# EAGLE design clock_v2 (EAGLE 9.1.3)
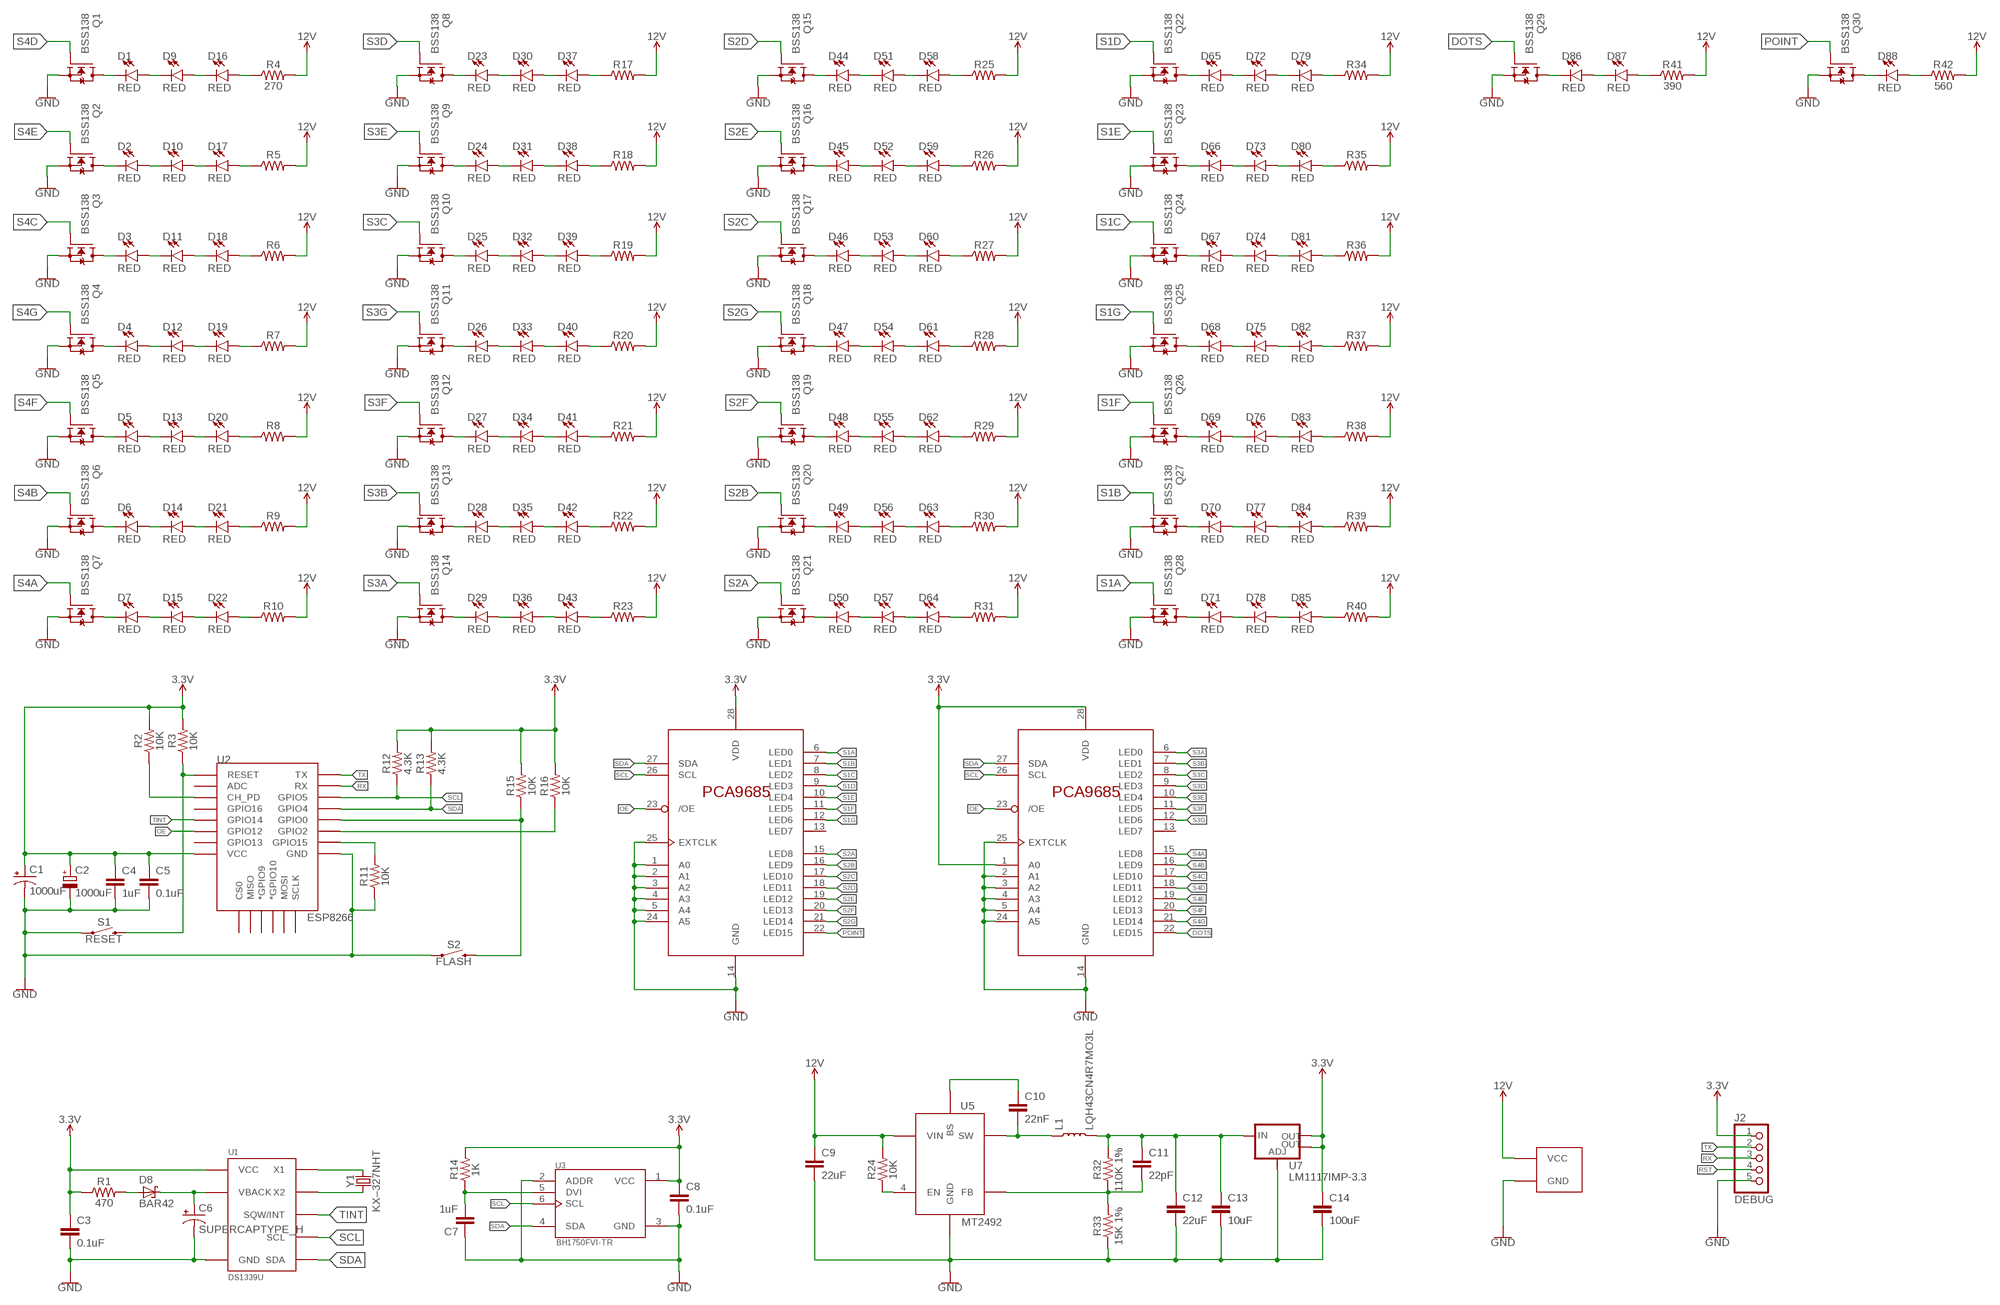
[diagram p0: schematic, sheet 1]

## Parts
C1  1000uF  CAP-RADIAL-8MM  [CAP_8X11.5_P-3.5]
C2  1000uF  CPOL-EUD/7343-31R  [D/7343-31R]
C3  0.1uF  1.0UF-1206-50V-10%  [1206]
C4  1uF  1.0UF-1206-50V-10%  [1206]
C5  0.1uF  1.0UF-1206-50V-10%  [1206]
C6  SUPERCAPTYPE_H  [IONISTOR_TYPE_H]
C7  1uF  1.0UF-1206-50V-10%  [1206]
C8  0.1uF  1.0UF-1206-50V-10%  [1206]
C9  22uF  1.0UF-1206-50V-10%  [1206]
C10  22nF  1.0UF-1206-50V-10%  [1206]
C11  22pF  1.0UF-1206-50V-10%  [1206]
C12  22uF  1.0UF-1206-50V-10%  [1206]
C13  10uF  1.0UF-1206-50V-10%  [1206]
C14  100uF  CAP_TANTALUM_C  [C/6032-28R]
D1  RED  LED-RED1206  [LED-1206]
D2  RED  LED-RED1206  [LED-1206]
D3  RED  LED-RED1206  [LED-1206]
D4  RED  LED-RED1206  [LED-1206]
D5  RED  LED-RED1206  [LED-1206]
D6  RED  LED-RED1206  [LED-1206]
D7  RED  LED-RED1206  [LED-1206]
D8  BAR42  [SOT23]
D9  RED  LED-RED1206  [LED-1206]
D10  RED  LED-RED1206  [LED-1206]
D11  RED  LED-RED1206  [LED-1206]
D12  RED  LED-RED1206  [LED-1206]
D13  RED  LED-RED1206  [LED-1206]
D14  RED  LED-RED1206  [LED-1206]
D15  RED  LED-RED1206  [LED-1206]
D16  RED  LED-RED1206  [LED-1206]
D17  RED  LED-RED1206  [LED-1206]
D18  RED  LED-RED1206  [LED-1206]
D19  RED  LED-RED1206  [LED-1206]
D20  RED  LED-RED1206  [LED-1206]
D21  RED  LED-RED1206  [LED-1206]
D22  RED  LED-RED1206  [LED-1206]
D23  RED  LED-RED1206  [LED-1206]
D24  RED  LED-RED1206  [LED-1206]
D25  RED  LED-RED1206  [LED-1206]
D26  RED  LED-RED1206  [LED-1206]
D27  RED  LED-RED1206  [LED-1206]
D28  RED  LED-RED1206  [LED-1206]
D29  RED  LED-RED1206  [LED-1206]
D30  RED  LED-RED1206  [LED-1206]
D31  RED  LED-RED1206  [LED-1206]
D32  RED  LED-RED1206  [LED-1206]
D33  RED  LED-RED1206  [LED-1206]
D34  RED  LED-RED1206  [LED-1206]
D35  RED  LED-RED1206  [LED-1206]
D36  RED  LED-RED1206  [LED-1206]
D37  RED  LED-RED1206  [LED-1206]
D38  RED  LED-RED1206  [LED-1206]
D39  RED  LED-RED1206  [LED-1206]
D40  RED  LED-RED1206  [LED-1206]
D41  RED  LED-RED1206  [LED-1206]
D42  RED  LED-RED1206  [LED-1206]
D43  RED  LED-RED1206  [LED-1206]
D44  RED  LED-RED1206  [LED-1206]
D45  RED  LED-RED1206  [LED-1206]
D46  RED  LED-RED1206  [LED-1206]
D47  RED  LED-RED1206  [LED-1206]
D48  RED  LED-RED1206  [LED-1206]
D49  RED  LED-RED1206  [LED-1206]
D50  RED  LED-RED1206  [LED-1206]
D51  RED  LED-RED1206  [LED-1206]
D52  RED  LED-RED1206  [LED-1206]
D53  RED  LED-RED1206  [LED-1206]
D54  RED  LED-RED1206  [LED-1206]
D55  RED  LED-RED1206  [LED-1206]
D56  RED  LED-RED1206  [LED-1206]
D57  RED  LED-RED1206  [LED-1206]
D58  RED  LED-RED1206  [LED-1206]
D59  RED  LED-RED1206  [LED-1206]
D60  RED  LED-RED1206  [LED-1206]
D61  RED  LED-RED1206  [LED-1206]
D62  RED  LED-RED1206  [LED-1206]
D63  RED  LED-RED1206  [LED-1206]
D64  RED  LED-RED1206  [LED-1206]
D65  RED  LED-RED1206  [LED-1206]
D66  RED  LED-RED1206  [LED-1206]
D67  RED  LED-RED1206  [LED-1206]
D68  RED  LED-RED1206  [LED-1206]
D69  RED  LED-RED1206  [LED-1206]
D70  RED  LED-RED1206  [LED-1206]
D71  RED  LED-RED1206  [LED-1206]
D72  RED  LED-RED1206  [LED-1206]
D73  RED  LED-RED1206  [LED-1206]
D74  RED  LED-RED1206  [LED-1206]
D75  RED  LED-RED1206  [LED-1206]
D76  RED  LED-RED1206  [LED-1206]
D77  RED  LED-RED1206  [LED-1206]
D78  RED  LED-RED1206  [LED-1206]
D79  RED  LED-RED1206  [LED-1206]
D80  RED  LED-RED1206  [LED-1206]
D81  RED  LED-RED1206  [LED-1206]
D82  RED  LED-RED1206  [LED-1206]
D83  RED  LED-RED1206  [LED-1206]
D84  RED  LED-RED1206  [LED-1206]
D85  RED  LED-RED1206  [LED-1206]
D86  RED  LED-RED1206  [LED-1206]
D87  RED  LED-RED1206  [LED-1206]
D88  RED  LED-RED1206  [LED-1206]
J1  POWER_SMD5.08  [POWER_SMD_5.08]
J2  DEBUG  ESP8266_DEBUG  [ESP8266_DEBUG]
L1  LQH43CN4R7MO3L  INDUCTOR_SMD_1812  [C1812]
Q1  BSS138  [SOT23]
Q2  BSS138  [SOT23]
Q3  BSS138  [SOT23]
Q4  BSS138  [SOT23]
Q5  BSS138  [SOT23]
Q6  BSS138  [SOT23]
Q7  BSS138  [SOT23]
Q8  BSS138  [SOT23]
Q9  BSS138  [SOT23]
Q10  BSS138  [SOT23]
Q11  BSS138  [SOT23]
Q12  BSS138  [SOT23]
Q13  BSS138  [SOT23]
Q14  BSS138  [SOT23]
Q15  BSS138  [SOT23]
Q16  BSS138  [SOT23]
Q17  BSS138  [SOT23]
Q18  BSS138  [SOT23]
Q19  BSS138  [SOT23]
Q20  BSS138  [SOT23]
Q21  BSS138  [SOT23]
Q22  BSS138  [SOT23]
Q23  BSS138  [SOT23]
Q24  BSS138  [SOT23]
Q25  BSS138  [SOT23]
Q26  BSS138  [SOT23]
Q27  BSS138  [SOT23]
Q28  BSS138  [SOT23]
Q29  BSS138  [SOT23]
Q30  BSS138  [SOT23]
R1  470  RESISTOR1206  [1206]
R2  10K  RESISTOR1206  [1206]
R3  10K  RESISTOR1206  [1206]
R4  270  RESISTOR1206  [1206]
R5  RESISTOR1206  [1206]
R6  RESISTOR1206  [1206]
R7  RESISTOR1206  [1206]
R8  RESISTOR1206  [1206]
R9  RESISTOR1206  [1206]
R10  RESISTOR1206  [1206]
R11  10K  RESISTOR1206  [1206]
R12  4.3K  RESISTOR1206  [1206]
R13  4.3K  RESISTOR1206  [1206]
R14  1K  RESISTOR1206  [1206]
R15  10K  RESISTOR1206  [1206]
R16  10K  RESISTOR1206  [1206]
R17  RESISTOR1206  [1206]
R18  RESISTOR1206  [1206]
R19  RESISTOR1206  [1206]
R20  RESISTOR1206  [1206]
R21  RESISTOR1206  [1206]
R22  RESISTOR1206  [1206]
R23  RESISTOR1206  [1206]
R24  10K  RESISTOR1206  [1206]
R25  RESISTOR1206  [1206]
R26  RESISTOR1206  [1206]
R27  RESISTOR1206  [1206]
R28  RESISTOR1206  [1206]
R29  RESISTOR1206  [1206]
R30  RESISTOR1206  [1206]
R31  RESISTOR1206  [1206]
R32  110K 1%  RESISTOR1206  [1206]
R33  15K 1%  RESISTOR1206  [1206]
R34  RESISTOR1206  [1206]
R35  RESISTOR1206  [1206]
R36  RESISTOR1206  [1206]
R37  RESISTOR1206  [1206]
R38  RESISTOR1206  [1206]
R39  RESISTOR1206  [1206]
R40  RESISTOR1206  [1206]
R41  390  RESISTOR1206  [1206]
R42  560  RESISTOR1206  [1206]
S1  RESET  MOMENTARY-SWITCH-SPST-SMD-5.2-REDUNDANT  [TACTILE_SWITCH_SMD_5.2MM]
S2  FLASH  MOMENTARY-SWITCH-SPST-SMD-5.2-REDUNDANT  [TACTILE_SWITCH_SMD_5.2MM]
U1  DS1339U  [DS1339U]
U2  ESP8266  ESP12ESMD  [ESP12E-SMD]
U3  BH1750FVI-TR  [SOTFL50P300X75-6N]
U4  PCA9685PW  [TSSOP28]
U5  MT2492  [SOT23-6]
U6  PCA9685PW  [TSSOP28]
U7  LM1117IMP-3.3  V_REG_LM1117SOT223  [SOT223]
Y1  KX–327NHT  [QSMD3.2X1.5]

## Nets
3.3V [power]: C1.+ C2.+ C3.1 C4.1 C5.1 C8.1 C14.+ J2.1 R1.1 R2.2 R3.2 R12.2 R13.2 R14.2 R15.2 R16.2 U1.8(VCC) U2.VCC U3.1(VCC) U4.28(VDD) U6.1(A0) U6.28(VDD) U7.2(OUT) U7.4(OUT)
12V [12V]: C9.1 J1.VCC R4.2 R5.2 R6.2 R7.2 R8.2 R9.2 R10.2 R17.2 R18.2 R19.2 R20.2 R21.2 R22.2 R23.2 R24.2 R25.2 R26.2 R27.2 R28.2 R29.2 R30.2 R31.2 R34.2 R35.2 R36.2 R37.2 R38.2 R39.2 R40.2 R41.2 R42.2 U5.5(VIN)
DOTS: Q29.1(G) U6.22(LED15)
FLASH: R15.1 S2.3 S2.4 U2.GPIO0
GND [power]: C1.- C2.- C3.2 C4.2 C5.2 C6.GND(-) C7.1 C8.2 C9.2 C12.2 C13.2 C14.- J1.GND J2.5 Q1.2(S) Q2.2(S) Q3.2(S) Q4.2(S) Q5.2(S) Q6.2(S) Q7.2(S) Q8.2(S) Q9.2(S) Q10.2(S) Q11.2(S) Q12.2(S) Q13.2(S) Q14.2(S) Q15.2(S) Q16.2(S) Q17.2(S) Q18.2(S) Q19.2(S) Q20.2(S) Q21.2(S) Q22.2(S) Q23.2(S) Q24.2(S) Q25.2(S) Q26.2(S) Q27.2(S) Q28.2(S) Q29.2(S) Q30.2(S) R11.1 R33.1 S1.1 S1.2 S2.1 S2.2 U1.4(GND) U2.GND U3.2(ADDR) U3.3(GND) U4.1(A0) U4.2(A1) U4.3(A2) U4.4(A3) U4.5(A4) U4.14(GND) U4.24(A5) U4.25(EXTCLK) U5.2(GND) U6.2(A1) U6.3(A2) U6.4(A3) U6.5(A4) U6.14(GND) U6.24(A5) U6.25(EXTCLK) U7.1(ADJ)
N$1: D1.C Q1.3(D)
N$2: D1.A D9.C
N$3: D2.C Q2.3(D)
N$4: D2.A D10.C
N$5: D3.C Q3.3(D)
N$6: D3.A D11.C
N$7: D11.A D18.C
N$8: D18.A R6.1
N$9: D4.C Q4.3(D)
N$10: D4.A D12.C
N$11: D12.A D19.C
N$12: D19.A R7.1
N$13: D7.C Q7.3(D)
N$14: D7.A D15.C
N$15: D50.C Q21.3(D)
N$16: D23.C Q8.3(D)
N$17: D23.A D30.C
N$18: D30.A D37.C
N$19: D37.A R17.1
N$20: D24.C Q9.3(D)
N$21: D24.A D31.C
N$22: D31.A D38.C
N$23: D38.A R18.1
N$24: D25.C Q10.3(D)
N$25: D25.A D32.C
N$26: D32.A D39.C
N$27: D39.A R19.1
N$28: D27.C Q12.3(D)
N$29: D50.A D57.C
N$30: D57.A D64.C
N$31: D49.C Q20.3(D)
N$32: D49.A D56.C
N$33: D56.A D63.C
N$34: D48.C Q19.3(D)
N$35: D48.A D55.C
N$36: D55.A D62.C
N$37: D47.C Q18.3(D)
N$38: D47.A D54.C
N$39: D54.A D61.C
N$40: D46.C Q17.3(D)
N$41: D46.A D53.C
N$42: D53.A D60.C
N$43: D44.C Q15.3(D)
N$44: D44.A D51.C
N$45: D51.A D58.C
N$46: D52.A D59.C
N$47: D45.A D52.C
N$48: D45.C Q16.3(D)
N$49: D64.A R31.1
N$50: D63.A R30.1
N$51: D62.A R29.1
N$52: D61.A R28.1
N$53: D60.A R27.1
N$54: D59.A R26.1
N$55: D58.A R25.1
N$56: D65.C Q22.3(D)
N$57: D86.A D87.C
N$58: D86.C Q29.3(D)
N$59: D9.A D16.C
N$60: D16.A R4.1
N$61: D10.A D17.C
N$62: D17.A R5.1
N$63: D15.A D22.C
N$64: D22.A R10.1
N$65: D6.C Q6.3(D)
N$66: D6.A D14.C
N$67: D14.A D21.C
N$68: D21.A R9.1
N$69: D5.C Q5.3(D)
N$70: D5.A D13.C
N$71: D13.A D20.C
N$72: D20.A R8.1
N$73: D88.C Q30.3(D)
N$74: D27.A D34.C
N$75: D87.A R41.1
N$76: D88.A R42.1
N$77: D34.A D41.C
N$78: D41.A R21.1
N$79: D28.C Q13.3(D)
N$80: D28.A D35.C
N$81: D35.A D42.C
N$82: D42.A R22.1
N$83: D29.C Q14.3(D)
N$84: D29.A D36.C
N$85: D36.A D43.C
N$86: D43.A R23.1
N$87: D26.C Q11.3(D)
N$88: D26.A D33.C
N$89: D33.A D40.C
N$90: D40.A R20.1
N$91: D65.A D72.C
N$92: D72.A D79.C
N$93: D79.A R34.1
N$94: D66.C Q23.3(D)
N$95: D66.A D73.C
N$96: D73.A D80.C
N$97: D80.A R35.1
N$98: D67.C Q24.3(D)
N$99: D67.A D74.C
N$100: D74.A D81.C
N$101: D81.A R36.1
N$102: D82.A R37.1
N$103: D75.A D82.C
N$104: D68.A D75.C
N$105: D68.C Q25.3(D)
N$106: D69.C Q26.3(D)
N$107: D69.A D76.C
N$108: D76.A D83.C
N$109: D83.A R38.1
N$110: D84.A R39.1
N$111: D77.A D84.C
N$112: D70.A D77.C
N$113: D70.C Q27.3(D)
N$114: D71.C Q28.3(D)
N$115: D71.A D78.C
N$116: D78.A D85.C
N$117: D85.A R40.1
N$118: C6.VCC(+) D8.3(C) U1.3(VBACK)
N$119: C7.2 R14.1 U3.5(DVI)
N$120: D8.1(A) R1.2
N$121: U1.1(X1) Y1.2
N$122: U1.2(X2) Y1.1
N$123: R11.2 U2.GPIO15
N$124: R2.1 U2.CH_PD
N$125: R16.1 U2.GPIO2
N$126: R24.1 U5.4(EN)
N$127: C10.1 U5.1(BS)
N$128: C10.2 L1.1 U5.6(SW)
N$129: C11.1 C12.1 C13.1 L1.2 R32.2 U7.3(IN)
N$130: C11.2 R32.1 R33.2 U5.3(FB)
OE: U2.GPIO12 U4.23(/OE) U6.23(/OE)
POINT: Q30.1(G) U4.22(LED15)
RST: J2.4 R3.1 S1.3 S1.4 U2.RESET
RX: J2.3 U2.RXD0(RX)
S1A: Q28.1(G) U4.6(LED0)
S1B: Q27.1(G) U4.7(LED1)
S1C: Q24.1(G) U4.8(LED2)
S1D: Q22.1(G) U4.9(LED3)
S1E: Q23.1(G) U4.10(LED4)
S1F: Q26.1(G) U4.11(LED5)
S1G: Q25.1(G) U4.12(LED6)
S2A: Q21.1(G) U4.15(LED8)
S2B: Q20.1(G) U4.16(LED9)
S2C: Q17.1(G) U4.17(LED10)
S2D: Q15.1(G) U4.18(LED11)
S2E: Q16.1(G) U4.19(LED12)
S2F: Q19.1(G) U4.20(LED13)
S2G: Q18.1(G) U4.21(LED14)
S3A: Q14.1(G) U6.6(LED0)
S3B: Q13.1(G) U6.7(LED1)
S3C: Q10.1(G) U6.8(LED2)
S3D: Q8.1(G) U6.9(LED3)
S3E: Q9.1(G) U6.10(LED4)
S3F: Q12.1(G) U6.11(LED5)
S3G: Q11.1(G) U6.12(LED6)
S4A: Q7.1(G) U6.15(LED8)
S4B: Q6.1(G) U6.16(LED9)
S4C: Q3.1(G) U6.17(LED10)
S4D: Q1.1(G) U6.18(LED11)
S4E: Q2.1(G) U6.19(LED12)
S4F: Q5.1(G) U6.20(LED13)
S4G: Q4.1(G) U6.21(LED14)
SCL: R12.1 U1.6(SCL) U2.GPIO5 U3.6(SCL) U4.26(SCL) U6.26(SCL)
SDA: R13.1 U1.5(SDA) U2.GPIO4 U3.4(SDA) U4.27(SDA) U6.27(SDA)
TINT: U1.7(SQW/INT) U2.GPIO14
TX: J2.2 U2.TXD0(TX)
Unconnected: U2.ADC U2.CS0 U2.GPIO9(*GPIO9) U2.GPIO10(*GPIO10) U2.GPIO13 U2.GPIO16 U2.MISO U2.MOSI U2.SCLK U4.13(LED7) U6.13(LED7)

## Library data of the parts
C1 = My:CAP: 1,000µF/1mF ceramic capacitors A capacitor is a passive two-terminal electrical component used to store electrical energy temporarily in an electric field. CAP-08070; PROD_ID: CAP-09538; VALUE: 1mF
C2 = rcl:CPOL-EU: POLARIZED CAPACITOR, European symbol; SPICEPREFIX: C
C3-C5 C7-C13 = SparkFun-Capacitors:1.0UF: 1µF ceramic capacitors A capacitor is a passive two-terminal electrical component used to store electrical energy temporarily in an electric field.; PROD_ID: CAP-09822; VALUE: 1.0uF
C6 = My:SUPERCAP
C14 = My:CAP_TANTALUM_C
D1-D7 D9-D88 = SparkFun-LED:LED-RED: Red SMD LED Used in manufacturing of most products at SparkFun Packages: 0603 - SMD 0603 package [Product Link] <http://docs.avagotech.com/docs/AV02-0551EN> 0603 SMART - SMD 0603 SMART package ( more efficient and expensive)[Product Link] <http://www.osram-os.com/Graphics/XPic2/00077099_0.pdf> 1206 - SMD1206 package [Product Link] <https://www.sparkfun.com/datasheets/DevTools/LilyPad/Q150OVS4.pdff> SparkFun Products: Pro Mini 328 -5V <https://www.sparkfun.com/products/821> RedBoard <https://www.sparkfun.com/products/12757> IOIO-OTG <https://www.sparkfun.com/products/13613>; PROD_ID: DIO-09912
D8 = My:BAR42: Silicon Schottky Diodes General-purpose diode for high-speed switching
J1 = My:POWER_SMD
J2 = My:ESP8266_DEBUG
L1 = My:INDUCTOR_SMD_1812
Q1-Q30 = bss138_10:BSS138: BSS138 N-Channel Logic Level Enhancement Mode Field Effect Transistor Source: http://www.fairchildsemi.com/datasheets/BS/BSS138.pdf; MF: Fairchild; MPN: BSS138; OC_FARNELL: 9845330; OC_NEWARK: 67R2009
R1-R42 = SparkFun-Resistors:RESISTOR: Generic Resistor Package
S1 S2 = SparkFun-Switches:MOMENTARY-SWITCH-SPST: Momentary Switch (Pushbutton) - SPST Normally-open (NO) SPST momentary switches (buttons, pushbuttons). Variants PTH-12MM - 12mm square, through-hole Momentary Pushbutton Switch - 12mm Square <https://www.sparkfun.com/products/9190> (COM-09190) PTH-6.0MM, PTH-6.0MM-KIT - 6.0mm square, through-hole Mini Pushbutton Switch <https://www.sparkfun.com/products/97> (COM-00097) KIT package intended for soldering kit's - only one side of pads' copper is exposed. PTH-RIGHT-ANGLE-KIT - Right-angle, through-hole Right Angle Tactile Button <https://www.sparkfun.com/products/10791> - Used on SparkFun BigTime Watch Kit <https://www.sparkfun.com/products/11734> SMD-12MM - 12mm square, surface-mount Tactile Button - SMD (12mm) <https://www.sparkfun.com/products/12993> (COM-12993) Used on SparkFun PicoBoard <https://www.sparkfun.com/products/11888> SMD-4.5MM - 4.5mm Square Trackball Switch Used on SparkFun Blackberry Trackballer Breakout <https://www.sparkfun.com/products/13169> SMD-4.6MMX2.8MM - 4.60mm x 2.80mm, surface mount Used on SparkFun SAMD21 Mini Breakout <https://www.sparkfun.com/products/13664> SMD-5.2MM, SMD-5.2-REDUNDANT - 5.2mm square, surface-mount Mini Pushbutton Switch - SMD <https://www.sparkfun.com/products/8720> (COM-08720) Used on Arduino Pro Mini <https://www.sparkfun.com/products/11114> REDUNDANT package connects both switch circuits together SMD-6.0X3.5MM - 6.0 x 3.5mm, surface mount Momentary Reset Switch SMD <https://www.sparkfun.com/products/8229> (COM-08229) SMD-6.2MM-TALL - 6.2mm square, surface mount Tactile Button - SMD (6mm) <https://www.sparkfun.com/products/12992> Used on SparkFun Digital Sandbox <https://www.sparkfun.com/products/12651> SMD-RIGHT-ANGLE - Right-angle, surface mount Used on SparkFun Block for Intel® Edison - Arduino <https://www.sparkfun.com/products/13036>; PROD_ID: SWCH-08247; SF_SKU: COM-08720
U1 = My:DS1339U
U2 = My:ESP12E: ESP12E Module
U3 = BH1750FVI-TR:BH1750FVI-TR: Light to Digital Ambient Light Sensor Digital O/P 1lux to 65535lux 6-Pin WSOF Embossed T/R; AVAILABILITY: Good; DESCRIPTION: Light to Digital Ambient Light Sensor Digital O/P 1lux to 65535lux 6-Pin WSOF Embossed T/R; MF: Rohm; MP: BH1750FVI-TR; PACKAGE: SMD-6 Rohm; PRICE: 2.17 USD
U4 U6 = i2c-led-controller:PCA9685
U5 = My:MT2492
U7 = SparkFun-IC-Power:V_REG_LM1117: Voltage Regulator LM1117 Standard adjustable voltage regulator but in SMD form. Spark Fun Electronics SKU : COM-00595; PROD_ID: VREG-08170
Y1 = My:KX–327NHT

## Net classes
0 default: width 0.203 mm
1 power: width 0.305 mm
2 12V: width 0.381 mm

## Board
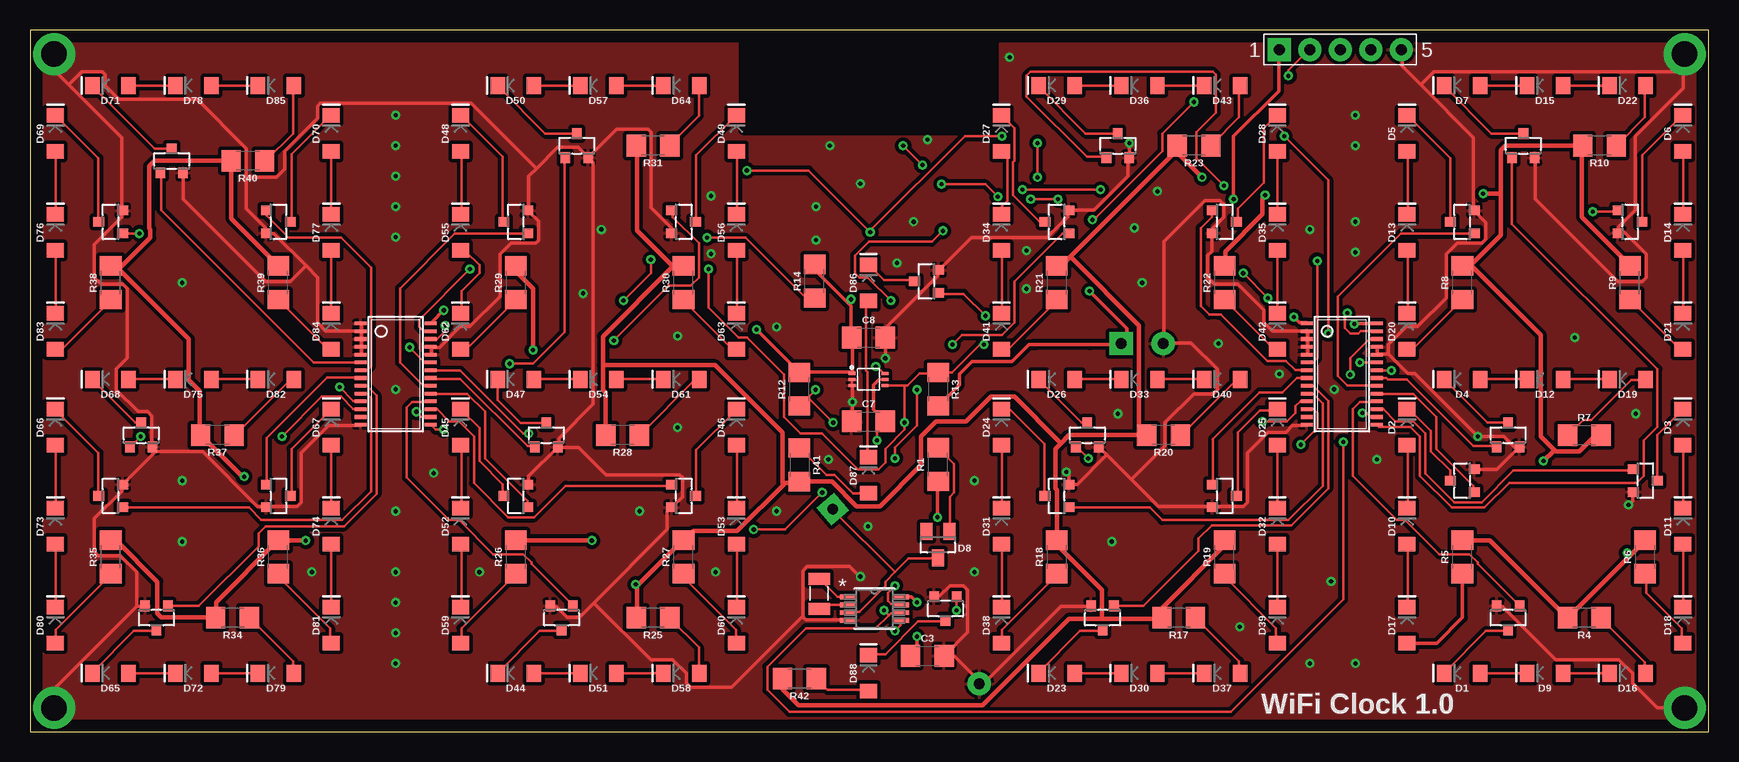
[diagram p1: board, top side]
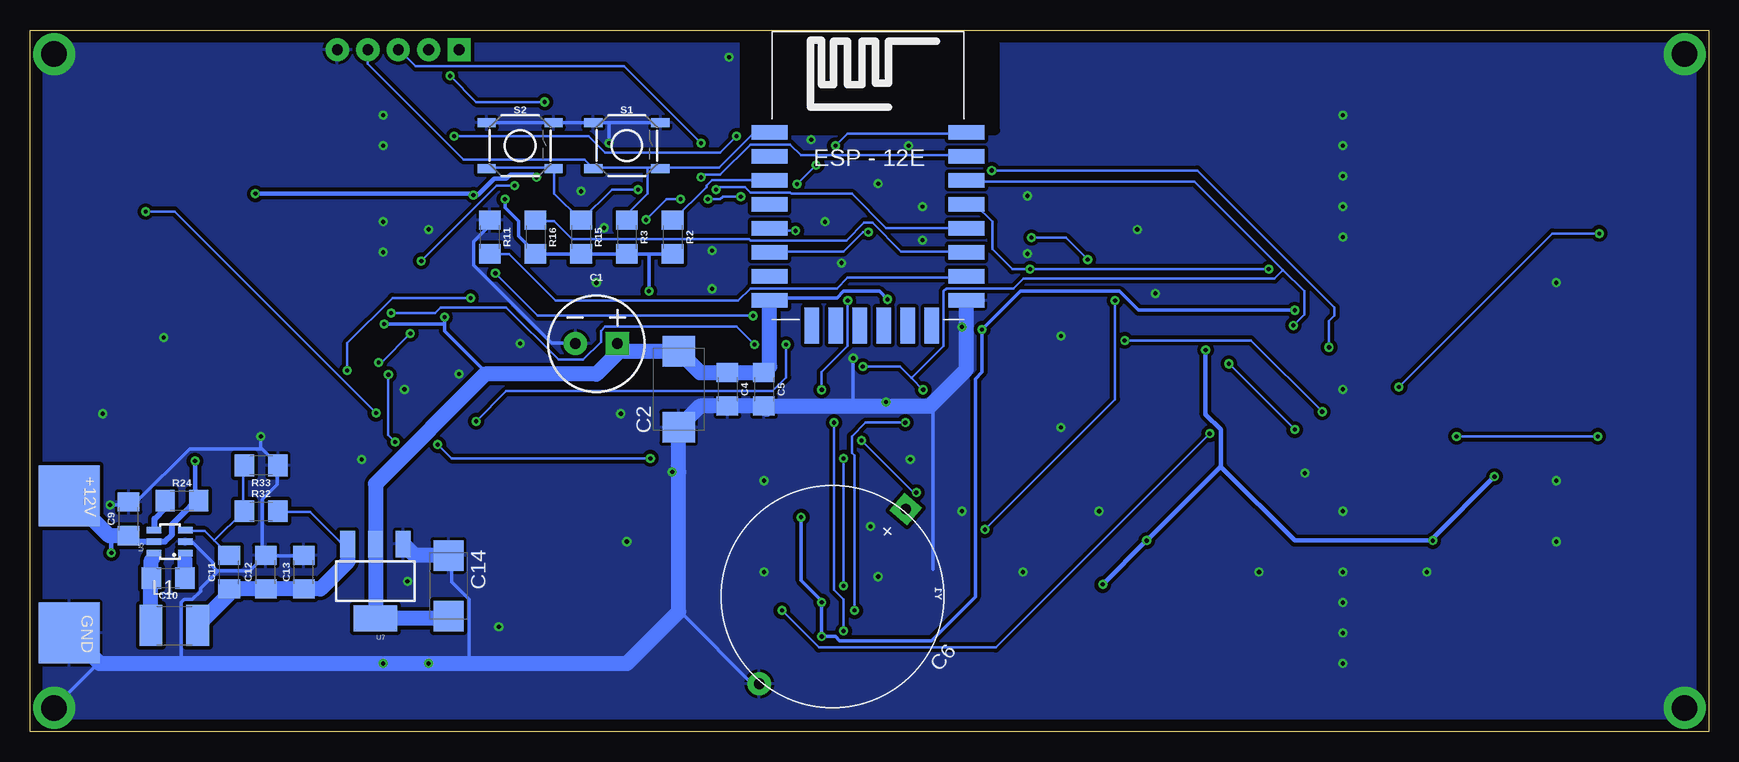
[diagram p2: board, bottom side, seen from below]

Size 139.92 x 58.54 mm. Coordinates in mm from the lower left corner, seen from the top.
Outline: 0,0 139.92,0 139.92,58.54 0,58.54 0,0
Copper layers (1*16): Top 0.035mm / dielectric 1.5mm / Bottom 0.035mm
Design rules "default *": minimum track width 6mil, minimum drill 0.35mm, track to track 10mil, track to pad 10mil, pad to pad 10mil, via to via 10mil, smd to smd 10mil, copper to edge 40mil, drill to drill 8mil, minimum pad ring 10mil, minimum via ring 8mil, stop-mask expansion 4mil, vias tented up to drill 0mil, thermal gap 10mil
tRestrict: area 59.4,50.2 to 80.4,59.1
bRestrict: area 59.4,50.2 to 80.4,59.1

### Footprints (pad centres in the part's own frame; a part is rotated, then mirrored left to right if it is on the bottom)
CAP_8X11.5_P-3.5 = drill 0.9 pad 1.93 square: + 1.75,0 | drill 0.9 pad 1.93: - -1.75,0
D/7343-31R = smd 2.55 x 2.7: + 3.175,0; - -3.175,0
1206 = smd 1.6 x 1.8: 1 -1.4,0; 2 1.4,0
IONISTOR_TYPE_H = drill 0.9 pad 1.93: GND 9.5,0 | drill 0.9 pad 1.93 square: VCC -9.5,0
C/6032-28R = smd 2.55 x 2.5: + 2.525,0; - -2.525,0
LED-1206 = smd 1.2 x 1.4: A -1.5,0; C 1.5,0
SOT23 = smd 1 x 1.4: 1 -0.95,-1.1; 2 0.95,-1.1; 3 0,1.1
POWER_SMD_5.08 = smd 5.08 x 5.08: GND -5.08,0; VCC 6.35,0
ESP8266_DEBUG = drill 0.9 pad 1.93 square: 1 -5.08,0 | drill 0.9 pad 1.93: 2 -2.54,0; 3 0,0; 4 2.54,0; 5 5.08,0
C1812 = smd 1.9 x 3.4: 1 -1.95,0; 2 1.95,0
SOT23' = smd 0.8 x 0.9: 1 -0.95,-1; 2 0.95,-1; 3 0,1
TACTILE_SWITCH_SMD_5.2MM = smd 1.524 x 0.762: 1 -2.794,1.905; 2 2.794,1.905; 3 -2.794,-1.905; 4 2.794,-1.905
DS1339U = smd 1.372 x 0.406: 1 -2.184,0.991; 2 -2.184,0.33; 3 -2.184,-0.33; 4 -2.184,-0.991; 5 2.184,-0.991; 6 2.184,-0.33; 7 2.184,0.33; 8 2.184,0.991
ESP12E-SMD = smd 3 x 1.2: ADC -8.3,3.8; CH_PD -8.3,1.8; GND 8.1,-8.2; GPIO0 8.1,-2.2; GPIO2 8.1,-4.2; GPIO4 8.1,-0.2; GPIO5 8.1,1.8; GPIO12 -8.3,-4.2; GPIO13 -8.3,-6.2; GPIO14 -8.3,-2.2; GPIO15 8.1,-6.2; GPIO16 -8.3,-0.2; RESET -8.3,5.8; RXD0 8.1,3.8; TXD0 8.1,5.8; VCC -8.3,-8.2 | smd 1.2 x 3: CS0 -4.8,-10.3; GPIO9 -0.8,-10.3; GPIO10 1.2,-10.3; MISO -2.8,-10.3; MOSI 3.2,-10.3; SCLK 5.2,-10.3
SOTFL50P300X75-6N = smd 0.55 x 0.3: 1 -1.375,0.525 | smd 0.55 x 0.25: 2 -1.375,0; 3 -1.375,-0.5; 4 1.375,-0.5; 5 1.375,0; 6 1.375,0.5
TSSOP28 = smd 0.305 x 0.991: 1 -4.225,-2.918; 2 -3.575,-2.918; 3 -2.925,-2.918; 4 -2.275,-2.918; 5 -1.625,-2.918; 6 -0.975,-2.918; 7 -0.325,-2.918; 8 0.325,-2.918; 9 0.975,-2.918; 10 1.625,-2.918; 11 2.275,-2.918; 12 2.925,-2.918; 13 3.575,-2.918; 14 4.225,-2.918; 15 4.225,2.918; 16 3.575,2.918; 17 2.925,2.918; 18 2.275,2.918; 19 1.625,2.918; 20 0.975,2.918; 21 0.325,2.918; 22 -0.325,2.918; 23 -0.975,2.918; 24 -1.625,2.918; 25 -2.275,2.918; 26 -2.925,2.918; 27 -3.575,2.918; 28 -4.225,2.918
SOT23-6 = smd 0.55 x 1.2: 1 -0.95,-1.3; 2 0,-1.3; 3 0.95,-1.3; 4 0.95,1.3; 5 0,1.3; 6 -0.95,1.3
SOT223 = smd 1.219 x 2.235: 1 -2.311,-3.099; 2 0,-3.099; 3 2.311,-3.099 | smd 3.6 x 2.2: 4 0,3.099
QSMD3.2X1.5 = smd 1 x 1.8: 1 -1.27,0; 2 1.23,0

### Placement (x,y rotation side)
C1  92.71,32.38 0 bottom
C2  85.85,28.58 90 bottom
C3  74.8,6.35 0 top
C4  81.79,28.58 270 bottom
C5  78.74,28.58 270 bottom
C6  73.02,11.3 230 bottom
C7  69.89,25.91 0 top
C8  69.89,32.89 0 top
C9  131.7,17.78 90 bottom
C10  128.4,12.83 180 bottom
C11  123.32,13.33 90 bottom
C12  120.27,13.33 90 bottom
C13  117.09,13.33 90 bottom
C14  105.03,12.19 270 bottom
D1  119.38,4.91 180 top
D2  114.78,25.41 90 top
D3  137.78,25.41 90 top
D4  119.38,29.41 180 top
D5  114.78,49.91 90 top
D6  137.78,49.91 90 top
D7  119.38,53.91 180 top
D8  75.67,15.62 180 top
D9  126.28,4.91 180 top
D10  114.78,17.16 90 top
D11  137.78,17.16 90 top
D12  126.28,29.41 180 top
D13  114.78,41.66 90 top
D14  137.78,41.66 90 top
D15  126.28,53.91 180 top
D16  133.18,4.91 180 top
D17  114.78,8.9 90 top
D18  137.78,8.9 90 top
D19  133.18,29.41 180 top
D20  114.78,33.41 90 top
D21  137.78,33.41 90 top
D22  133.18,53.91 180 top
D23  85.58,4.91 180 top
D24  80.98,25.41 90 top
D25  103.98,25.41 90 top
D26  85.58,29.41 180 top
D27  80.98,49.91 90 top
D28  103.98,49.91 90 top
D29  85.58,53.91 180 top
D30  92.48,4.91 180 top
D31  80.98,17.16 90 top
D32  103.98,17.16 90 top
D33  92.48,29.41 180 top
D34  80.98,41.66 90 top
D35  103.98,41.66 90 top
D36  92.48,53.91 180 top
D37  99.38,4.91 180 top
D38  80.98,8.9 90 top
D39  103.98,8.9 90 top
D40  99.38,29.41 180 top
D41  80.98,33.41 90 top
D42  103.98,33.41 90 top
D43  99.38,53.91 180 top
D44  40.48,4.91 180 top
D45  35.88,25.41 90 top
D46  58.88,25.41 90 top
D47  40.48,29.41 180 top
D48  35.88,49.91 90 top
D49  58.88,49.91 90 top
D50  40.48,53.91 180 top
D51  47.38,4.91 180 top
D52  35.88,17.16 90 top
D53  58.88,17.16 90 top
D54  47.38,29.41 180 top
D55  35.88,41.66 90 top
D56  58.88,41.66 90 top
D57  47.38,53.91 180 top
D58  54.29,4.91 180 top
D59  35.88,8.9 90 top
D60  58.88,8.9 90 top
D61  54.29,29.41 180 top
D62  35.88,33.41 90 top
D63  58.88,33.41 90 top
D64  54.29,53.91 180 top
D65  6.71,4.91 180 top
D66  2.11,25.41 90 top
D67  25.11,25.41 90 top
D68  6.71,29.41 180 top
D69  2.11,49.91 90 top
D70  25.11,49.91 90 top
D71  6.71,53.91 180 top
D72  13.61,4.91 180 top
D73  2.11,17.16 90 top
D74  25.11,17.16 90 top
D75  13.61,29.41 180 top
D76  2.11,41.66 90 top
D77  25.11,41.66 90 top
D78  13.61,53.91 180 top
D79  20.51,4.91 180 top
D80  2.11,8.9 90 top
D81  25.11,8.9 90 top
D82  20.51,29.41 180 top
D83  2.11,33.41 90 top
D84  25.11,33.41 90 top
D85  20.51,53.91 180 top
D86  69.89,37.45 90 top
D87  69.89,21.41 90 top
D88  69.89,4.91 90 top
J1  136.65,13.33 90 bottom
J2  109.22,56.9 0 top
L1  127.89,8.89 0 bottom
Q1  BSS138  [SOT23']  123.21,9.53 180 top
Q2  BSS138  [SOT23']  119.4,20.96 90 top
Q3  BSS138  [SOT23']  134.64,20.96 270 top
Q4  BSS138  [SOT23']  123.21,24.77 0 top
Q5  BSS138  [SOT23']  119.4,42.55 90 top
Q6  BSS138  [SOT23']  133.37,42.55 270 top
Q7  BSS138  [SOT23']  124.48,48.9 0 top
Q8  BSS138  [SOT23']  89.41,9.53 180 top
Q9  BSS138  [SOT23']  85.6,19.69 90 top
Q10  BSS138  [SOT23']  99.57,19.69 270 top
Q11  BSS138  [SOT23']  88.14,24.77 0 top
Q12  BSS138  [SOT23']  85.6,42.55 90 top
Q13  BSS138  [SOT23']  99.57,42.55 270 top
Q14  BSS138  [SOT23']  90.68,48.9 0 top
Q15  BSS138  [SOT23']  44.31,9.53 180 top
Q16  BSS138  [SOT23']  40.51,19.69 90 top
Q17  BSS138  [SOT23']  54.48,19.69 270 top
Q18  BSS138  [SOT23']  43.05,24.77 0 top
Q19  BSS138  [SOT23']  40.51,42.55 90 top
Q20  BSS138  [SOT23']  54.48,42.55 270 top
Q21  BSS138  [SOT23']  45.59,48.9 0 top
Q22  BSS138  [SOT23']  10.54,9.53 180 top
Q23  BSS138  [SOT23']  6.73,19.69 90 top
Q24  BSS138  [SOT23']  20.7,19.69 270 top
Q25  BSS138  [SOT23']  9.27,24.77 0 top
Q26  BSS138  [SOT23']  6.73,42.55 90 top
Q27  BSS138  [SOT23']  20.7,42.55 270 top
Q28  BSS138  [SOT23']  11.81,47.62 0 top
Q29  BSS138  [SOT23']  74.73,37.58 90 top
Q30  BSS138  [SOT23']  76.31,10.29 180 top
R1  75.69,22.3 90 top
R2  86.36,41.27 270 bottom
R3  90.17,41.27 270 bottom
R4  129.56,9.53 180 top
R5  119.4,14.6 90 top
R6  134.64,14.6 90 top
R7  129.56,24.77 0 top
R8  119.4,37.47 90 top
R9  133.37,37.47 90 top
R10  130.83,48.9 180 top
R11  101.6,41.27 270 bottom
R12  64.13,28.58 90 top
R13  75.69,28.58 270 top
R14  65.4,37.59 90 top
R15  93.98,41.27 270 bottom
R16  97.79,41.27 270 bottom
R17  95.76,9.53 180 top
R18  85.6,14.6 90 top
R19  99.57,14.6 90 top
R20  94.49,24.77 180 top
R21  85.6,37.47 90 top
R22  99.57,37.47 90 top
R23  97.03,48.9 180 top
R24  127.25,19.3 0 bottom
R25  51.94,9.53 180 top
R26  40.51,14.6 90 top
R27  54.48,14.6 90 top
R28  49.4,24.77 180 top
R29  40.51,37.47 90 top
R30  54.48,37.47 90 top
R31  51.94,48.9 180 top
R32  120.65,18.42 0 bottom
R33  120.65,22.23 180 bottom
R34  16.89,9.53 180 top
R35  6.73,14.6 90 top
R36  20.7,14.6 90 top
R37  15.62,24.77 180 top
R38  6.73,37.47 90 top
R39  20.7,37.47 90 top
R40  18.16,47.62 180 top
R41  64.13,22.28 270 top
R42  64.13,4.45 180 top
S1  90.17,48.9 0 bottom
S2  99.06,48.9 0 bottom
U1  70.4,10.29 0 top
U2  69.96,44.2 0 bottom
U3  69.89,29.41 0 top
U4  30.48,29.85 270 top
U5  128.27,15.88 90 bottom
U6  109.35,29.85 270 top
U7  111.12,12.57 180 bottom
Y1  65.79,11.56 90 top

### Tracks (layer width: path | path; a pad name or v marks a point on that pad's centre or on a via)
3.3V  (via drill 0.35)
  Top 0.305: v100.33,44.43 100.33,49.68 104.1,53.45 104.1,56.88 J2.1 | v105.36,34.59 105.82,34.14 106.39,34.14 U6.1 | 83.82,32.31 88.33,32.31 90.96,32.31 C1.+ 91.44,32.38 91.44,33.66 v88.33,36.77 | 83.82,32.31 83.53,32.31 | 75.76,27.28 R13.2 77.47,28.95 77.47,29.85 78.52,30.9 81.85,30.9 83.26,32.31 83.82,32.31 | v73.93,10.82 73.47,11.28 72.67,11.28 U1.8 | v73.93,7.96 73.93,6.82 73.47,6.36 C3.1 | v75.64,17.91 75.64,20.88 R1.1 | 68.15,35.8 68.44,35.51 68.44,32.99 C8.1 68.55,32.88 68.55,30.02 U3.1 68.44,30.02 64.21,30.02 R12.2 64.1,30.02 v60.55,33.57 | 68.15,35.8 65.47,38.48 65.47,38.94 R14.2 | v34.49,35.17 33.47,34.14 U4.28 | v68.44,36.08 68.21,35.85 68.15,35.8 | U6.28 110.43,34.07 v110.39,34.02
  Bottom 0.305: 88.33,39.85 90.16,39.85 R3.2 90.27,39.85 93.93,39.85 R15.2 94.04,39.85 97.7,39.85 R16.2 97.81,39.97 99.19,41.34 99.19,42.6 100.33,43.74 v100.33,44.43 | 88.33,39.85 86.38,39.85 R2.2 | 105.36,34.02 105.36,33.45 102.27,30.37 101.98,29.85 | 105.36,34.02 v105.36,34.59 | v110.39,34.02 105.47,34.02 105.36,34.02 | v88.33,36.77 88.33,39.74 88.33,39.85 | v75.64,17.91 75.64,12.65 73.93,10.93 v73.93,10.82 v73.93,7.96 73.81,7.96 72.78,7.96 72.44,7.62 64.78,7.62 61.12,11.28 61.12,29.45 60.55,30.02 60.55,33.45 v60.55,33.57 57.35,36.77 49.12,36.77 47.52,35.17 v34.49,35.17 | v68.44,36.08 69.13,36.77 72.1,36.77 72.67,36.2 77.7,36.2 U2.VCC
  Bottom 1.27: C14.+ 105.22,9.47 U7.4 111.12,14.73 | U7.2 111.12,14.73 | U2.VCC 78.26,30.46 C5.1 C4.1 84.08,29.98 C2.+ 90.32,31.75 C1.+ 90.96,31.6 92.71,29.85 101.98,29.85 111.12,20.7 111.12,14.73
12V  (via drill 0.35)
  Top 0.381: R39.2 20.66,38.94 16.78,42.82 16.78,47.62 R40.2 16.66,47.62 10.38,47.62 9.92,47.17 9.92,42.02 10.03,41.91 10.03,41.22 7.52,38.71 R38.2 6.83,38.82 7.18,38.82 13.23,32.77 13.23,29.34 14.15,28.42 14.15,24.77 R37.2 | 47.75,30.59 47.75,32.99 53.58,38.82 | 47.75,30.59 47.75,28.54 47.98,28.31 47.98,24.77 R28.2 | 53.58,38.82 54.38,38.82 R30.2 | R31.2 50.61,48.88 50.61,41.8 53.47,38.94 53.58,38.82 | R35.2 6.83,15.96 7.18,15.96 10.61,12.54 10.61,9.91 10.95,9.56 15.41,9.56 R34.2 15.52,9.56 15.52,10.82 20.66,15.96 R36.2 20.89,15.96 v22.99,15.96 | 50.61,12.19 50.61,9.56 R25.2 | 50.61,12.19 54.38,15.96 R27.2 54.61,16.08 55.3,16.76 58.95,16.76 62.84,20.65 | v46.84,15.96 40.55,15.96 R26.2 | v50.49,12.31 50.61,12.19 | 62.84,20.65 62.95,20.77 64.1,20.77 R41.2 64.32,20.88 66.84,20.88 68.9,18.82 70.84,18.82 74.27,22.25 74.27,24.65 75.53,25.91 78.04,25.91 80.1,27.96 82.04,27.96 85.81,24.19 85.93,24.08 | v41.92,31.85 41.92,37 40.55,38.37 40.55,38.82 R29.2 | 47.75,30.59 47.87,30.59 57.12,30.59 62.73,24.99 62.73,20.77 62.84,20.65 | 14.38,24.77 R37.2 | R5.2 119.42,15.96 121.7,15.96 128.11,9.56 R4.2 128.22,9.56 133.36,14.71 | 133.36,14.71 134.62,15.96 R6.2 | v133.13,14.93 133.25,14.82 133.36,14.71 | 122.62,44.88 122.62,48.54 122.96,48.88 129.36,48.88 R10.2 129.36,48.77 129.36,42.94 133.36,38.94 R9.2 | 122.62,44.88 122.62,41.45 120.1,38.94 119.42,38.94 R8.2 120.22,38.82 125.93,33.11 125.93,24.65 127.08,23.51 | 127.08,23.51 127.19,23.39 129.13,23.39 130.5,24.77 130.85,24.77 R7.2 | v126.16,22.59 126.96,23.39 127.08,23.51 | 86.73,39.62 95.53,48.43 95.53,48.88 R23.2 95.64,48.31 v97.7,46.25
  Top 0.381: 86.73,39.62 86.04,38.94 85.7,38.94 R21.2 | v102.96,44.77 102.73,44.54 102.73,43.17 99.64,40.08 99.64,38.94 R22.2 | 63.18,4.42 62.84,4.42 | 89.36,9.45 94.27,9.45 R17.2 94.39,9.68 94.39,10.36 99.53,15.51 99.53,15.96 R19.2 | 89.36,9.45 86.61,9.45 79.41,2.25 64.05,2.25 62.74,3.56 62.84,3.66 62.84,4.42 | 62.84,4.42 R42.2 | 89.36,9.45 89.36,9.56 89.36,11.85 85.7,15.51 85.7,15.96 R18.2 85.58,16.19 85.58,20.19 85.47,20.31 85.47,23.62 85.93,24.08 | 85.93,24.08 86.61,24.77 93.02,24.77 R20.2 92.44,24.88 92.44,33.91 86.84,39.51 86.73,39.62 | v121.13,44.88 122.5,44.88 122.62,44.88 | R37.2 17.69,21.3 v17.84,21.3
  Bottom 0.381: v50.49,12.31 v46.84,15.96 46.72,16.08 40.66,22.14 | v41.92,31.85 41.92,26.48 40.66,25.22 40.66,22.14 | v22.99,15.96 34.49,15.96 40.55,22.02 40.66,22.14 | 23.1,16.08 v22.99,15.96 | v133.13,14.93 133.13,15.85 133.13,16.38 | v126.16,22.59 126.16,19.51 R24.2 | v97.7,46.25 97.93,46.48 99.87,46.48 100.22,46.14 101.24,46.14 102.62,44.77 v102.96,44.77 103.07,44.88 v121.13,44.88 | 22.99,16.15 v22.99,15.96 | v17.84,21.3 22.99,16.15 | 22.99,16.15 v22.99,15.96
  Bottom 0.508: C9.1 131.19,15.88 U5.5 128.65,15.88 128.08,16.45 128.08,17.31 127.13,18.26 127.13,18.29 126.11,19.3 R24.2
  Bottom 1.27: J1.VCC 133.35,16.38 133.13,16.38 C9.1
DOTS  (via drill 0.35)
  Top 0.203: v79.64,34.71 77.81,36.54 75.76,36.54 Q29.1 | v103.19,36.2 v101.13,38.25 | v113.47,30.14 112.33,30.14 U6.22
  Bottom 0.203: v79.64,34.71 97.59,34.71 v101.13,38.25 | v103.19,36.2 109.7,36.2 113.47,32.42 v113.47,30.14
FLASH  (via drill 0.35)
  Top 0.203: v89.24,45.23 v82.73,45.23
  Bottom 0.203: S2.3 101.82,47.05 96.33,47.05 S2.4 96.21,46.94 96.21,44.88 94.04,42.71 R15.1 93.93,42.71 91.41,45.23 v89.24,45.23 | v82.73,45.23 82.5,45.45 80.33,45.45 79.87,45 76.56,45 76.44,44.88 71.41,44.88 68.55,42.02 61.93,42.02 U2.GPIO0
GND  (via drill 0.35, 2.1 pad 3.5)
  Top 0.203: 68.52,29.38 U3.3 68.52,28.61 68.55,28.58 | 68.52,29.38 68.51,29.39 | U3.2 68.52,29.38
  Top 0.305: U4.5 27.64,31.51 27.64,32.08 U4.4 27.64,32.2 27.64,32.65 U4.3 27.64,32.88 27.64,33.34 U4.2 | 23.01,38.88 23.98,37.91 23.98,34.14 24.66,33.45 27.52,33.45 U4.2 | 23.01,38.88 20.32,41.57 19.75,41.57 Q27.2 19.63,41.68 19.63,42.02 18.03,43.62 18.03,46.25 | Q28.2 12.78,46.6 12.78,44.43 19.63,37.57 21.69,37.57 22.95,38.82 23.01,38.88 | U4.1 27.64,34.02 27.64,33.57 U4.2 | 3.23,53.97 2.03,55.17 2.03,56.43 v2,56.54 | 3.23,53.97 7.63,49.57 7.63,43.51 Q26.2 7.63,43.4 7.63,42.94 5.35,40.65 5.35,37.91 5.92,37.34 7.75,37.34 8.09,37 8.09,31.17 7.18,30.25 7.18,28.54 9,26.71 9.8,26.71 10.15,26.37 10.15,23.85 Q25.2 | 8.89,10.48 9.58,10.48 Q22.2 | 8.89,10.48 2.03,3.62 2.03,2.02 v2,2 | Q25.2 10.26,23.74 10.61,23.39 14.38,23.39 18.95,18.82 19.63,18.82 Q24.2 19.75,18.82 22.26,18.82 22.61,19.16 22.61,23.28 24.89,25.57 27.52,25.57 U4.14 | Q25.2 10.49,23.39 7.75,20.65 Q23.2 7.63,20.54 7.63,20.08 5.35,17.79 5.35,15.05 5.69,14.71 7.52,14.71 8.89,13.33 8.89,10.59 8.89,10.48 | 18.03,46.25 18.03,48.65 13.92,52.77 7.4,52.77 6.26,53.91 6.26,54.83 6.03,55.05 4.32,55.05 3.29,54.03 3.23,53.97 | Q7.2 125.48,47.85 125.48,44.43 132.33,37.57 134.39,37.57 134.73,37.91 134.73,39.85 132.91,41.68 132.56,41.68 Q6.2 132.45,41.68 132.45,42.14 133.82,43.51 133.82,49.68 137.82,53.68 137.82,56.43 v137.92,56.54 137.71,55.05 117.02,55.05 115.99,54.03 115.93,53.97 | U6.25 112.33,32.08 112.33,31.51 U6.24 112.45,31.51 113.25,31.51 | Q2.2 120.45,21.91 122.28,21.91 124.1,23.74 Q4.2 123.88,23.62 122.85,24.65 v120.67,24.65 115.42,29.91 114.85,29.91 113.25,31.51 | 115.93,53.97 114.39,55.51 114.39,56.88 J2.5
  Top 0.305: 115.93,53.97 120.33,49.57 120.33,43.51 Q5.2 120.45,43.4 121.36,42.48 121.36,41.11 121.02,40.77 118.96,40.77 118.05,39.85 118.05,36.2 115.65,33.8 114.73,33.8 113.25,32.31 113.25,31.62 113.25,31.51 | Q16.2 41.58,20.65 41.58,21.34 43.98,23.74 Q18.2 44.09,23.74 | 47.01,10.76 53.12,16.88 53.12,18.36 53.47,18.71 Q17.2 53.58,18.82 54.38,19.62 54.38,21.22 54.15,21.45 49.53,21.45 | 47.01,10.76 45.81,9.56 44.78,9.56 43.87,10.48 43.41,10.48 Q15.2 | 44.09,23.74 45.72,23.74 48.01,21.45 49.53,21.45 | 49.53,21.45 49.01,21.45 | U4.24 33.47,31.51 33.47,32.08 U4.25 33.58,32.08 34.15,32.08 35.87,33.8 36.66,33.8 39.18,36.31 39.18,39.85 40.09,40.77 42.15,40.77 42.38,41 42.38,42.6 41.58,43.4 Q19.2 41.58,43.51 41.58,46.37 42.21,47 | Q20.2 53.47,41.68 53.47,42.02 51.75,43.74 51.75,50.02 51.52,50.25 48.9,50.25 46.61,47.97 Q21.2 | 42.21,47 43.98,48.77 45.7,48.77 46.49,47.97 Q21.2 | Q21.2 46.61,47.85 46.95,47.51 46.95,27.34 44.09,24.49 44.09,23.74 | v91.64,49.11 91.64,47.97 Q14.2 91.53,47.85 91.53,46.37 88.67,43.51 86.61,43.51 Q12.2 86.5,43.4 86.5,42.94 84.78,41.22 78.5,41.22 75.87,38.59 Q29.2 75.64,38.48 75.64,38.02 71.3,33.68 71.3,32.99 C8.2 71.3,32.77 v71.3,31.17 | 89.76,23.11 89.13,23.74 Q11.2 | 89.76,23.11 91.81,21.05 | 91.81,21.05 94.04,18.82 98.5,18.82 Q10.2 98.62,18.82 101.13,18.82 101.47,19.16 101.47,23.28 103.19,24.99 104.67,24.99 105.24,25.57 106.39,25.57 U6.14 | 89.76,23.11 89.7,23.05 87.3,20.65 86.61,20.65 Q9.2 86.61,20.77 86.61,21.45 v86.38,21.68 | U6.5 106.5,31.51 106.5,32.08 U6.4 106.5,32.2 106.5,32.65 U6.3 106.5,32.88 106.5,33.34 U6.2 103.56,33.42 102.84,34.14 102.84,35.17 100.67,37.34 98.73,37.34 98.16,37.91 98.16,39.74 98.5,40.08 98.5,41.57 Q13.2 98.62,41.68 98.62,42.02 99.53,42.94 99.53,43.97 99.19,44.31 97.93,44.31 94.5,40.88 94.5,32.42 C1.- 94.61,32.42 96.79,32.42 98.96,30.25 98.96,28.54 98.62,28.19 97.02,28.19 94.61,25.79 94.61,23.85 91.87,21.11 91.81,21.05
  Top 0.305: v133.25,18.94 133.59,19.28 133.59,19.96 Q3.2 | Q30.2 75.41,11.39 75.87,11.39 76.67,12.19 77.81,12.19 78.16,11.85 78.16,8.31 76.21,6.36 C3.2 76.67,6.71 79.18,4.19 C6.GND 79.18,4.08 79.53,4.08 85.93,10.48 88.44,10.48 Q8.2 | 64.44,9.56 64.67,9.33 68.21,9.33 U1.4 | 64.44,9.56 64.44,13.45 64.78,13.79 68.33,13.79 69.13,12.99 v69.21,12.95 | 68.55,28.77 68.55,28.58 v68.55,27.51 68.55,25.91 C7.1 | Q1.2 122.28,10.48 122.73,10.48 127.19,6.02 132.45,6.02 133.59,4.88 133.59,4.08 135.65,2.02 137.82,2.02 v137.92,2 | 47.01,10.76 47.07,10.71 51.75,6.02 53.58,6.02 54.72,4.88 54.72,4.08 55.07,3.73 58.5,3.73 64.32,9.56 64.44,9.56 | 18.03,46.25 18.15,46.25 20.55,46.25 21.23,46.94 21.23,48.43 23.98,51.17 23.98,52.2 24.21,52.43 36.78,52.43 42.15,47.05 42.21,47
  Bottom 0.305: 91.64,50.83 92.9,50.83 S1.1 93.02,50.83 96.21,50.83 S2.2 96.33,50.83 101.82,50.83 S2.1 | 91.64,50.83 87.41,50.83 S1.2 | v91.64,49.11 91.64,50.71 91.64,50.83 | R11.1 101.7,42.6 101.7,42.14 102.96,40.88 102.96,38.94 96.44,32.42 94.5,32.42 C1.- | v133.25,18.94 131.99,18.94 131.76,19.16 C9.2 131.65,19.28 130.96,19.28 126.62,23.62 120.67,23.62 | 124.33,13.45 124.68,13.79 124.68,14.13 126.39,15.85 126.96,15.85 U5.2 | 124.33,13.45 121.59,13.45 120.33,14.71 C12.2 | C13.2 117.13,14.71 120.22,14.71 C12.2 | C12.2 120.45,14.82 120.56,14.93 120.56,19.39 119.3,20.65 119.3,22.14 R33.1 119.3,22.37 120.56,23.62 120.67,23.62 | v68.55,27.51 68.55,27.18 | 134.11,5.71 134.62,5.33 137.94,2.02 v137.92,2 | 64.67,13.56 64.67,26.59 64.9,27.18 | C14.- 104.79,14.13 104.79,12.54 103.3,11.05 103.3,6.25 103.3,5.71 | C6.GND 79.18,4.08 79.76,4.08 85.36,9.68 85.85,10.03 | 124.33,13.45 124.33,13.33 125.7,11.96 125.7,11.73 126.39,11.05 127.08,11.05 127.3,10.82 127.3,6.25 127.3,5.71 | v86.38,21.68 85.85,21.68 | v71.3,31.17 71.3,27.74 71.3,27.18 | v120.67,24.65 120.67,23.74 120.67,23.62
  Bottom 1.27: C14.- 107.86,14.72 U7.1 | C5.2 C4.2 84.08,27.18 C2.- 85.85,21.68 85.85,10.03 90.17,5.71 | C5.2 71.3,27.18 68.55,27.18 64.9,27.18 61.86,30.21 U2.GND | J1.GND 134.11,5.71 127.3,5.71 103.3,5.71 90.17,5.71 | 90.17,5.71 | 78.49,26.92 C5.2
  other vias: 30.48,28.58 30.48,18.42 30.48,13.33 30.48,10.79 30.48,8.25 30.48,5.71 30.48,41.27 30.48,43.81 30.48,46.36 30.48,48.9 30.48,51.44 12.7,15.88 12.7,20.96 106.68,5.71 110.49,5.71 110.49,51.44 110.49,48.9 110.49,42.55 110.49,40.01 78.74,13.33 78.74,20.96 12.7,37.47 23.5,13.33 37.47,13.33 33.66,21.59 53.98,25.4 53.98,33.02 50.8,18.42 57.15,13.33 62.23,18.42 69.85,17.14 90.17,15.88 100.84,8.76 108.46,12.57 112.27,22.73 128.78,32.89 133.86,26.54 90.68,26.54 106.68,41.91 81.66,56.26 47.62,41.91 56.77,44.7 69.21,45.72 65.53,41.02 73.66,42.55 46.1,36.58 92.71,37.47 93.98,45.09 83.06,40.13 83.06,36.96 92.07,42.04 99.06,32.38 62.23,33.78 108.71,28.58 104.14,29.85 56.77,39.88 66.55,22.73 66.67,48.9 74.8,49.4 65.53,43.81 72.26,39.12
  pour Bottom: 64.26,13.59 69.85,13.59 69.85,8.76 67.31,8.76 67.31,9.53 69.09,9.53 69.09,10.41 66.8,10.41 66.8,8.89 64.26,8.89
  pour Bottom (isolate 0.305): -1.27,59.05 140.97,59.05 140.97,-0.64 -1.27,-0.64
  pour Top (isolate 0.305): -2.54,59.05 140.97,59.05 140.97,-0.64 -2.54,-0.64
N$1
  Top 0.203: Q1.3 123.19,8.42 121.36,8.42 117.93,4.99 D1.C
N$2
  Top 0.203: D1.A 120.9,4.88 124.68,4.88 D9.C
N$3
  Top 0.203: Q2.3 118.39,20.99 118.39,21.79 116.79,23.39 116.79,25.11 115.07,26.82 114.85,26.82 D2.C
N$4
  Top 0.203: D10.C 114.85,18.71 114.85,23.85 D2.A
N$5
  Top 0.203: Q3.3 135.65,20.99 135.65,24.77 137.71,26.82 D3.C
N$6
  Top 0.203: D11.C 137.82,18.71 137.82,23.85 D3.A
N$7
  Top 0.203: D18.C 137.82,10.48 137.82,15.62 D11.A
N$8
  Top 0.203: D18.A 137.71,7.51 137.71,8.65 134.73,11.62 134.73,13.11 R6.1
N$9
  Top 0.203: Q4.3 123.19,25.79 121.48,25.79 117.93,29.34 D4.C
N$10
  Top 0.203: D4.A 120.9,29.45 124.68,29.45 D12.C
N$11
  Top 0.203: D12.A 127.88,29.45 131.65,29.45 D19.C
N$12
  Top 0.203: D19.A 134.62,29.34 133.48,29.34 130.16,26.02 129.48,26.02 128.22,24.77 R7.1
N$13
  Top 0.203: Q7.3 124.45,49.91 121.82,49.91 117.93,53.8 D7.C
N$14
  Top 0.203: D7.A 120.9,53.91 124.68,53.91 D15.C
N$15
  Top 0.203: Q21.3 45.58,49.91 42.95,49.91 39.06,53.8 D50.C
N$16
  Top 0.203: Q8.3 89.36,8.42 87.53,8.42 84.1,4.99 D23.C
N$17
  Top 0.203: D23.A 87.18,4.88 90.96,4.88 D30.C
N$18
  Top 0.203: D30.A 94.04,4.88 97.81,4.88 D37.C
N$19
  Top 0.203: D37.A 100.79,4.99 100.79,5.91 97.24,9.45 R17.1
N$20
  Top 0.203: Q9.3 84.56,19.74 84.56,24.03 81.28,27.3 80.98,27 D24.C 81.01,26.82
N$21
  Top 0.203: D31.C 81.01,18.71 81.01,23.85 D24.A
N$22
  Top 0.203: D38.C 81.01,10.48 81.01,15.62 D31.A
N$23
  Top 0.203: D38.A 81.01,7.51 81.01,8.53 85.58,13.11 R18.1
N$24
  Top 0.203: Q10.3 100.67,19.74 100.67,24.99 102.5,26.82 103.87,26.82 D25.C
N$25
  Top 0.203: D32.C 103.99,18.71 103.99,23.85 D25.A
N$26
  Top 0.203: D39.C 103.99,10.48 103.99,15.62 D32.A
N$27
  Top 0.203: D39.A 103.87,7.51 103.87,8.65 99.64,12.88 99.64,13.11 R19.1
N$28
  Top 0.203: Q12.3 84.56,42.6 84.1,42.6 81.93,44.77 81.93,47.51 82.04,47.62 82.04,50.37 81.01,51.4 D27.C
N$29
  Top 0.203: D50.A 42.04,53.91 45.81,53.91 D57.C
N$30
  Top 0.203: D57.A 48.9,53.91 D64.C
N$31
  Top 0.203: Q20.3 55.52,42.6 55.52,48.08 58.84,51.4 D49.C
N$32
  Top 0.203: D56.C 58.95,43.17 58.95,48.31 D49.A
N$33
  Top 0.203: D63.C 58.95,34.94 58.95,40.08 D56.A
N$34
  Top 0.203: Q19.3 39.41,42.6 39.41,47.97 35.98,51.4 D48.C
N$35
  Top 0.203: D55.C 35.98,43.17 35.98,48.31 D48.A
N$36
  Top 0.203: D62.C 35.98,34.94 35.98,36.77 37.47,38.25 37.47,38.94 36.32,40.08 35.98,40.08 D55.A
N$37
  Top 0.203: 42.95,25.79 Q18.3 40.91,25.77 38.98,27.69 D47.C 39.06,29.34
N$38
  Top 0.203: D47.A 42.04,29.45 45.81,29.45 D54.C
N$39
  Top 0.203: D54.A 48.9,29.45 52.78,29.45 D61.C
N$40
  Top 0.203: Q17.3 55.52,19.74 55.52,23.51 58.84,26.82 D46.C
N$41
  Top 0.203: D53.C 58.95,18.71 58.95,23.85 D46.A
N$42
  Top 0.203: D60.C 58.95,10.48 58.95,15.62 D53.A
N$43
  Top 0.203: Q15.3 44.21,8.42 42.49,8.42 39.06,4.99 D44.C
N$44
  Top 0.203: D44.A 42.04,4.88 45.81,4.88 D51.C
N$45
  Top 0.203: D51.A 48.9,4.88 52.78,4.88 D58.C
N$46
  Top 0.203: D59.C 35.98,10.48 35.98,15.62 D52.A
N$47
  Top 0.203: D52.C 35.98,18.71 35.98,23.85 D45.A
N$48
  Top 0.203: Q16.3 39.41,19.74 39.41,20.65 37.47,22.59 37.47,25.34 35.98,26.82 D45.C
N$49
  Top 0.203: D64.A 55.75,53.8 55.75,51.4 53.35,49 R31.1
N$50
  Top 0.203: D63.A 58.84,31.97 58.5,31.97 54.5,35.97 R30.1
N$51
  Top 0.203: D62.A 35.98,31.97 36.44,31.97 40.44,35.97 R29.1
N$52
  Top 0.203: D61.A 55.75,29.34 55.41,29.34 50.84,24.77 R28.1
N$53
  Top 0.203: D60.A 58.84,7.51 58.84,8.53 54.5,12.88 54.5,13.11 R27.1
N$54
  Top 0.203: D59.A 35.98,7.51 35.98,8.65 40.44,13.11 R26.1
N$55
  Top 0.203: D58.A 55.75,4.99 55.75,7.05 53.35,9.45 R25.1
N$56
  Top 0.203: Q22.3 10.49,8.42 8.66,8.42 5.23,4.99 D65.C
N$57
  Top 0.203: D87.C 69.81,22.94 69.81,30.02 69.7,30.14 69.7,35.74 69.81,35.85 D86.A
N$58
  Top 0.203: Q29.3 73.7,37.68 71.18,37.68 69.93,38.94 D86.C
N$59
  Top 0.203: D9.A 127.88,4.88 131.65,4.88 D16.C
N$60
  Top 0.203: D16.A 134.62,4.99 134.62,5.79 130.96,9.45 R4.1
N$61
  Top 0.203: D17.C 114.85,10.48 114.85,15.62 D10.A
N$62
  Top 0.203: 114.85,7.51 D17.A | 119.3,13.11 R5.1
  Top 0.305: D17.A 117.26,7.41 119.4,9.54 R5.1
N$63
  Top 0.203: D15.A 127.88,53.91 131.65,53.91 D22.C
N$64
  Top 0.203: D22.A 134.62,53.8 134.62,51.28 132.33,49 R10.1
N$65
  Top 0.203: Q6.3 134.39,42.6 134.39,48.08 137.71,51.4 D6.C
N$66
  Top 0.203: D14.C 137.82,43.17 137.82,48.31 D6.A
N$67
  Top 0.203: D21.C 137.82,34.94 137.82,40.08 D14.A
N$68
  Top 0.203: D21.A 137.71,31.97 137.48,31.97 133.48,35.97 R9.1
N$69
  Top 0.203: Q5.3 118.39,42.6 118.39,47.85 114.85,51.4 D5.C
N$70
  Top 0.203: D13.C 114.85,43.17 114.85,48.31 D5.A
N$71
  Top 0.203: D20.C 114.85,34.94 114.85,40.08 D13.A
N$72
  Top 0.203: D20.A 114.85,31.97 115.3,31.97 119.3,35.97 R8.1
N$73
  Top 0.203: Q30.3 76.21,9.22 74.04,9.22 71.3,6.48 69.93,6.48 D88.C
N$74
  Top 0.203: D34.C 81.01,43.17 81.01,43.85 81.47,44.31 81.47,47.85 81.01,48.31 D27.A
N$75
  Top 0.203: 64.9,23.62 64.21,23.62 R41.1 66.38,21.43 67.07,21.43 68.59,19.91 D87.A 69.81,19.96
N$76
  Top 0.203: D88.A 69.81,3.5 66.5,3.5 65.58,4.42 R42.1
N$77
  Top 0.203: D41.C 81.01,34.94 81.01,40.08 D34.A
N$78
  Top 0.203: D41.A 81.01,31.97 81.58,31.97 85.58,35.97 R21.1
N$79
  Top 0.203: Q13.3 100.67,42.6 100.67,43.62 102.84,45.8 102.84,50.37 103.87,51.4 D28.C
N$80
  Top 0.203: D35.C 103.99,43.17 103.99,48.31 D28.A
N$81
  Top 0.203: D42.C 103.99,34.94 103.99,40.08 D35.A
N$82
  Top 0.203: D42.A 103.87,31.97 103.64,31.97 99.64,35.97 R22.1
N$83
  Top 0.203: Q14.3 90.61,49.91 87.99,49.91 84.1,53.8 D29.C
N$84
  Top 0.203: D29.A 87.18,53.91 90.96,53.91 D36.C
N$85
  Top 0.203: D36.A 94.04,53.91 97.81,53.91 D43.C
N$86
  Top 0.203: D43.A 100.79,53.8 100.79,51.28 98.5,49 R23.1
N$87
  Top 0.203: Q11.3 88.1,25.79 87.64,25.79 84.1,29.34 D26.C
N$88
  Top 0.203: D26.A 87.18,29.45 90.96,29.45 D33.C
N$89
  Top 0.203: D33.A 94.04,29.45 97.81,29.45 D40.C
N$90
  Top 0.203: D40.A 100.79,29.34 100.56,29.34 95.99,24.77 R20.1
N$91
  Top 0.203: D65.A 8.32,4.88 12.09,4.88 D72.C
N$92
  Top 0.203: D72.A 15.18,4.88 18.95,4.88 D79.C
N$93
  Top 0.203: D79.A 21.92,4.99 21.92,5.91 18.38,9.45 R34.1
N$94
  Top 0.203: Q23.3 5.69,19.74 5.69,23.28 2.15,26.82 D66.C
N$95
  Top 0.203: D73.C 2.15,18.71 2.15,23.85 D66.A
N$96
  Top 0.203: D80.C 2.15,10.48 2.15,15.62 D73.A
N$97
  Top 0.203: D80.A 2.15,7.51 2.15,8.53 6.72,13.11 R35.1
N$98
  Top 0.203: Q24.3 21.81,19.74 21.81,23.62 25.01,26.82 D67.C
N$99
  Top 0.203: D74.C 25.12,18.71 25.12,23.85 D67.A
N$100
  Top 0.203: D81.C 25.12,10.48 25.12,15.62 D74.A
N$101
  Top 0.203: D81.A 25.01,7.51 25.01,8.65 20.78,12.88 20.78,13.11 R36.1
N$102
  Top 0.203: D82.A 21.92,29.34 21.69,29.34 17.12,24.77 R37.1
N$103
  Top 0.203: D75.A 15.18,29.45 18.95,29.45 D82.C
N$104
  Top 0.203: D68.A 8.32,29.45 12.09,29.45 D75.C
N$105
  Top 0.203: Q25.3 9.23,25.79 8.78,25.79 5.23,29.34 D68.C
N$106
  Top 0.203: Q26.3 5.69,42.6 5.69,47.85 2.15,51.4 D69.C
N$107
  Top 0.203: D76.C 2.15,43.17 2.15,48.31 D69.A
N$108
  Top 0.203: D83.C 2.15,34.94 2.15,40.08 D76.A
N$109
  Top 0.203: D83.A 2.15,31.97 2.72,31.97 6.72,35.97 R38.1
N$110
  Top 0.203: D84.A 25.01,31.97 24.78,31.97 20.78,35.97 R39.1
N$111
  Top 0.203: D84.C 25.12,34.94 25.12,40.08 D77.A
N$112
  Top 0.203: D77.C 25.12,43.17 25.12,48.31 D70.A
N$113
  Top 0.203: Q27.3 21.81,42.6 21.81,48.2 25.01,51.4 D70.C
N$114
  Top 0.203: Q28.3 11.75,48.65 10.38,48.65 5.23,53.8 D71.C
N$115
  Top 0.203: D71.A 8.32,53.91 12.09,53.91 D78.C
N$116
  Top 0.203: D78.A 15.18,53.91 18.95,53.91 D85.C
N$117
  Top 0.203: D85.A 21.92,53.8 21.92,49.91 19.63,47.62 R40.1
N$118
  Top 0.203: 72.1,13.33 73.24,14.48 75.64,14.48 D8.3 | 72.1,13.33 71.3,12.54 71.3,12.19 69.13,10.02 68.33,10.02 U1.3 | 72.1,13.33 66.95,18.48 C6.VCC
N$119  (via drill 0.35)
  Top 0.203: v56.44,41.22 59.64,41.22 64.67,36.2 65.35,36.2 R14.1 | v51.75,39.4 51.75,38.25 v49.47,35.97 | v60.33,16.88 62.95,16.88 v66.04,19.96 | v70.61,24.31 70.61,25.34 71.18,25.91 C7.2 | 70.73,29.34 70.79,29.41 U3.5
  Top 0.305: C7.2 70.32,26.88 70.32,28.93 70.73,29.34
  Bottom 0.203: v56.44,41.22 53.58,41.22 v51.75,39.4 | v49.47,35.97 49.47,27.74 v60.33,16.88 | v66.04,19.96 66.27,19.96 v70.61,24.31
N$120
  Top 0.203: D8.1 76.67,16.76 76.67,19.62 77.01,19.96 77.01,22.37 75.76,23.62 R1.2
N$121
  Top 0.203: U1.1 67.3,11.28 65.81,12.76 Y1.2
N$122
  Top 0.203: U1.2 68.21,10.59 66.04,10.59 65.81,10.36 Y1.1
N$123
  Bottom 0.203: R11.2 101.59,39.85 99.99,39.85 96.1,35.97 80.9,35.97 79.87,37 72.67,37 71.75,37.91 61.93,37.91 U2.GPIO15
N$124
  Bottom 0.203: R2.1 86.27,42.71 83.53,45.45 83.53,45.57 83.07,46.02 78.27,46.02 U2.CH_PD
N$125
  Bottom 0.203: R16.1 97.7,42.6 96.21,42.6 94.73,41.11 79.98,41.11 79.87,41 71.87,41 70.38,42.48 69.7,42.48 67.3,40.08 61.93,40.08 U2.GPIO2
N$126
  Bottom 0.508: U5.4 129.54,16.86 129.54,17.78 128.65,18.67 R24.1
N$127
  Bottom 0.508: 127,14.35 126.97,14.38 U5.1
  Bottom 1.27: C10.1 127,14.35
N$128
  Bottom 0.508: 129.67,14.48 129.67,14.83 U5.6
  Bottom 1.27: L1.1 129.84,12.79 C10.2 129.8,14.35 129.67,14.48
N$129
  Bottom 0.203: R32.2 119.19,18.36 116.56,18.36 114.05,15.85 U7.3
  Bottom 1.27: U7.3 113.44,14.2 115.7,11.93 C13.1 C12.1 C11.1 123.32,11.51 L1.2
N$130
  Bottom 0.203: 124.56,15.96 123.42,14.82 C11.2 | 124.56,15.96 125.36,16.76 126.96,16.76 U5.3 | 124.56,15.96 122.16,18.36 R32.1 122.16,18.48 122.16,22.14 R33.2
OE  (via drill 0.35)
  Top 0.203: v31.64,32.08 32.89,30.82 33.35,30.82 U4.23 | v59.75,46.83 64.9,46.83 v70.04,41.68 70.04,41.8 77.93,49.68 v81.01,49.68 | v110.85,30.82 112.22,30.82 U6.23 | v108.22,33.22 108.22,46.02 v104.56,49.68
  Bottom 0.203: v31.64,32.08 31.64,34.25 31.18,34.71 31.18,35.4 42.61,46.83 v59.75,46.83 | v70.04,41.68 70.5,41.68 72.1,40.08 78.16,40.08 U2.GPIO12 | v110.85,30.82 110.62,30.82 v108.22,33.22 | v104.56,49.68 93.36,49.68 91.99,48.31 82.38,48.31 v81.01,49.68
POINT  (via drill 0.35)
  Top 0.203: v77.24,10.13 77.24,11.28 Q30.1 | v41.58,24.88 41.12,24.88 35.87,30.14 33.47,30.14 U4.22
  Bottom 0.203: v77.24,10.13 74.15,7.05 59.41,7.05 v41.58,24.88
RST
  Bottom 0.203: 88.44,47.05 92.9,47.05 S1.3 93.02,47.05 93.7,47.74 103.76,47.74 111.76,55.74 111.76,56.88 J2.4 | 88.44,47.05 87.41,47.05 S1.4 87.3,47.05 82.5,47.05 79.64,49.91 78.27,49.91 U2.RESET | 88.44,47.05 88.44,44.88 90.16,43.17 90.16,42.71 R3.1
RX  (via drill 0.35)
  Top 0.203: v83.98,49.11 v83.98,46.25
  Bottom 0.203: v83.98,46.25 83.76,46.48 82.38,46.48 79.87,49 76.56,49 75.64,48.08 61.93,48.08 U2.RXD0 | v83.98,49.11 90.39,55.51 107.76,55.51 109.13,56.88 J2.3
S1A
  Top 0.203: Q28.1 10.95,46.6 10.95,43.51 23.64,30.82 27.52,30.82 U4.6
S1B
  Top 0.203: Q27.1 19.75,43.4 19.75,43.05 21.58,41.22 25.92,41.22 28.44,38.71 28.44,30.48 28.12,30.17 U4.7
S1C
  Top 0.203: Q24.1 19.75,20.65 19.75,24.54 24.78,29.57 27.52,29.57 U4.8
S1D
  Top 0.203: 11.52,10.59 Q22.1 14.08,10.52 19.05,15.49 19.05,16.56 19.65,17.16 26.2,17.16 28.89,19.85 28.89,28.08 28.1,28.87 U4.9
S1E
  Top 0.203: Q23.1 7.75,18.71 18.26,18.71 19.29,17.68 26.04,17.68 28.44,20.08 28.44,27.85 28.09,28.19 27.64,28.19 U4.10
S1F  (via drill 0.35)
  Top 0.203: v9.12,41.57 7.75,41.57 Q26.1 | v25.81,28.77 26.95,27.62 27.52,27.62 U4.11
  Bottom 0.203: v9.12,41.57 13,41.57 v25.81,28.77
S1G  (via drill 0.35)
  Top 0.203: v9.23,24.65 8.43,23.85 Q25.1 | v21.01,24.65 24.32,27.96 25.92,27.96 26.95,26.94 27.52,26.94 U4.12
  Bottom 0.203: v21.01,24.65 v9.23,24.65
S2A  (via drill 0.35)
  Top 0.203: v39.98,30.71 41.92,30.71 44.55,33.34 44.55,47.85 Q21.1 | v34.49,25.22 33.81,25.22 33.47,25.57 U4.15
  Bottom 0.203: v34.49,25.22 v39.98,30.71
S2B  (via drill 0.35)
  Top 0.203: v48.67,32.65 53.24,37.22 55.07,37.22 55.75,37.91 55.75,38.73 55.75,40.77 53.58,42.94 53.58,43.4 Q20.1 | U4.16 32.65,26.27 v32.21,26.71
  Bottom 0.203: v48.67,32.65 38.15,32.65 v32.21,26.71
S2C
  Top 0.203: Q17.1 53.47,20.54 44.67,20.54 42.04,17.91 39.87,17.91 37.01,20.77 37.01,24.65 35.75,25.91 34.95,25.91 33.94,26.92 U4.17
S2D
  Top 0.203: Q15.1 45.24,10.59 41.81,14.02 41.81,14.13 41.12,14.82 38.61,14.82 35.75,17.68 34.95,17.68 31.41,21.22 31.41,27.05 31.86,27.51 33.35,27.51 U4.18
S2E
  Top 0.203: Q16.1 41.47,18.82 41.47,19.28 37.92,22.82 37.92,26.71 36.44,28.19 33.47,28.19 U4.19
S2F
  Top 0.203: Q19.1 41.47,41.57 35.41,41.57 30.84,37 30.84,30.82 32.78,28.88 33.35,28.88 U4.20
S2G
  Top 0.203: Q18.1 42.04,23.85 41.47,23.85 35.87,29.45 33.47,29.45 U4.21
S3A  (via drill 0.35)
  Top 0.203: v99.53,45.57 97.24,47.85 97.24,50.02 98.84,51.63 98.84,54.83 98.62,55.05 83.41,55.05 83.07,54.71 83.07,53 88.1,47.97 89.7,47.97 Q14.1 | v107.3,39.28 107.3,31.17 106.96,30.82 106.5,30.82 U6.6
  Bottom 0.203: v99.53,45.57 101.02,45.57 v107.3,39.28
S3B
  Top 0.203: Q13.1 98.5,43.4 98.5,42.94 97.59,42.02 97.59,35.51 98.3,34.8 99.06,34.8 | 99.19,34.8 99.06,34.8 | U6.7 105.47,30.17 104.69,30.95 103.13,30.95 99.28,34.8 99.06,34.8
S3C
  Top 0.203: Q10.1 98.62,20.65 98.62,24.45 102.49,28.32 104.39,28.32 105.59,29.52 U6.8
S3D
  Top 0.203: 90.39,10.59 Q8.1 92.82,10.52 97.41,15.11 97.41,16.13 98.5,17.22 105.13,17.22 108.22,20.31 108.22,27.62 106.97,28.87 U6.9
S3E
  Top 0.203: Q9.1 86.61,18.71 93.36,18.71 94.39,17.68 104.9,17.68 107.76,20.54 107.76,27.39 106.96,28.19 106.5,28.19 U6.10
S3F  (via drill 0.35)
  Top 0.203: v76.9,32.31 77.7,33.11 81.01,33.11 82.04,34.14 82.04,37.57 86.04,41.57 86.5,41.57 Q12.1 | v102.73,25.91 104.79,25.91 105.47,26.59 105.47,27.17 105.88,27.57 U6.11
  Bottom 0.203: v76.9,32.31 76.9,29.57 78.04,28.42 100.22,28.42 v102.73,25.91
S3G  (via drill 0.35)
  Top 0.203: v88.21,22.82 87.3,23.74 Q11.1 | v105.93,23.96 107.3,25.34 107.3,26.59 106.98,26.92 U6.12
  Bottom 0.203: v88.21,22.82 104.79,22.82 v105.93,23.96
S4A
  Top 0.203: Q7.1 123.53,47.85 123.53,42.37 135.65,30.25 135.65,25.45 134.51,24.31 134.51,21.34 133.93,20.77 123.3,20.77 121.25,18.71 118.5,18.71 115.88,21.34 115.88,24.65 115.07,25.45 112.45,25.45 112.33,25.57 U6.15
S4B  (via drill 0.35)
  Top 0.203: v130.28,43.4 132.33,43.4 Q6.1 | v111.07,26.59 111.42,26.59 111.74,26.27 U6.16
  Bottom 0.203: v130.28,43.4 127.88,43.4 v111.07,26.59
S4C
  Top 0.203: Q3.1 133.59,21.79 123.65,21.79 121.02,19.16 118.73,19.16 116.33,21.57 116.33,24.88 115.3,25.91 113.82,25.91 112.8,26.92 U6.17
S4D
  Top 0.203: Q1.1 124.1,10.59 120.67,14.02 120.67,14.13 119.99,14.82 117.47,14.82 114.62,17.68 113.93,17.68 110.27,21.34 110.27,26.94 110.85,27.51 112.22,27.51 U6.18
S4E
  Top 0.203: Q2.1 120.33,20.08 120.33,20.54 117.25,23.62 117.25,26.25 115.3,28.19 112.33,28.19 U6.19
S4F
  Top 0.203: Q5.1 120.33,41.57 114.27,41.57 109.02,36.31 109.02,29.68 109.82,28.88 112.22,28.88 U6.20
S4G
  Top 0.203: Q4.1 122.16,23.85 120.33,23.85 114.78,29.4 113.17,29.4 113.05,29.52 U6.21
SCL  (via drill 0.35)
  Top 0.203: v70.5,30.48 70.61,30.48 71.18,29.91 U3.6 | v65.47,28.54 64.21,27.28 R12.1 64.9,27.85 v66.95,25.79 | v34.61,33.91 34.61,33.45 33.93,32.77 U4.26 | v110.04,29.79 110.04,31.17 111.65,32.77 112.22,32.77 U6.26 | v109.47,24.19 109.47,11.05 100.1,1.68 63.3,1.68 61.47,3.5 61.47,5.45 64.67,8.65 70.5,8.65 71.58,9.73 | 71.58,9.73 71.75,9.91 72.55,9.91 U1.6 | v71.18,10.13 71.53,9.79 71.58,9.73
  Bottom 0.203: v70.5,30.48 67.41,30.48 66.44,29.51 | v65.47,28.54 66.44,29.51 | v34.61,33.91 33.69,34.82 33.69,36.77 35.47,38.54 | 35.47,38.54 42.84,45.91 61.81,45.91 U2.GPIO5 | 66.44,29.51 66.38,29.57 63.75,32.2 63.75,36.77 63.52,37 57.93,37 57.12,37.8 36.21,37.8 35.52,38.48 35.47,38.54 | v110.04,29.79 110.04,24.77 v109.47,24.19 | v66.95,25.79 70.27,25.79 71.41,24.65 71.41,23.28 71.18,23.05 v71.18,10.13
SDA  (via drill 0.35)
  Top 0.203: v36.66,38.59 32.44,34.37 32.44,33.8 32.78,33.45 33.35,33.45 U4.27 | 72.9,28.88 73.13,28.88 74.15,29.91 75.64,29.91 R13.1 | 72.9,28.88 71.3,28.88 U3.4 | v109.82,34.94 109.59,34.71 109.59,33.68 110.04,33.22 110.73,33.22 110.93,33.42 U6.27 | 75.76,30.02 R13.1 | v72.1,8.42 72.55,8.88 72.55,9.22 U1.5 | 72.9,28.88 v72.9,25.79 72.9,25.22 71.3,23.62 71.3,22.48 70.73,21.91 69.01,21.91 66.04,24.88 64.21,24.88 62.84,26.25 62.84,29.79 59.75,32.88 59.07,32.88 56.55,35.4 v56.55,38.59 | R13.1 76.84,29.98 79.17,32.31 v79.53,32.31
  Bottom 0.203: 61.12,43.97 61.81,43.97 U2.GPIO4 61.14,44 59.69,42.55 59.69,40.26 58.03,38.59 v56.55,38.59 v36.66,38.59 | v109.82,34.94 106.16,34.94 105.7,35.4 100.22,35.4 95.87,31.05 93.81,31.05 92.33,32.54 92.33,33.45 91.99,33.8 81.01,33.8 v79.53,32.31 | v72.1,8.42 72.1,11.05 72.9,11.85 v72.9,25.79
TINT  (via drill 0.35)
  Top 0.203: v72.1,12.19 71.53,11.62 71.53,10.93 71.75,10.71 72.55,10.71 U1.7 | v72.1,22.82 72.1,23.74 73.93,25.57 v73.93,28.54 | v71.75,35.97 69.81,37.91 69.13,37.91 68.78,38.25 68.78,39.74 69.93,40.88 75.18,40.88 v76.1,41.8
  Bottom 0.203: v72.1,22.82 v72.1,12.19 | v73.93,28.54 73.93,30.02 71.75,32.2 v71.75,35.97 | v76.1,41.8 78.04,41.8 78.16,41.91 U2.GPIO14
TX  (via drill 0.35)
  Top 0.203: v74.38,47.28 v72.78,48.88 | v75.98,45.68 79.64,45.68 v80.67,44.65 | v85.7,44.43 v83.41,44.43 | v88.56,42.71 88.79,42.94 88.9,42.94 94.39,48.43 94.39,49.91 v97.02,52.54 | v104.9,54.71 104.9,55.17 106.62,56.88 J2.2
  Bottom 0.203: v72.78,48.88 71.75,49.91 61.93,49.91 U2.TXD0 | v75.98,45.68 v74.38,47.28 | v80.67,44.65 82.16,44.65 82.38,44.43 v83.41,44.43 | v85.7,44.43 86.84,44.43 v88.56,42.71 | v97.02,52.54 102.73,52.54 v104.9,54.71

### Text on the board
tNames: WiFi Clock 1.0
bNames: +12V | GND